# EasyEDA schematic 1-Schematic_kr04.json

## Sheets
1 Processor_Board_1: TITLE: Принципиальная схема блока процессора; REV: 1.4; Date: 2023-12-02; Sheet: 1/2; Drawn By: Romych; Company: zx-pk.ru
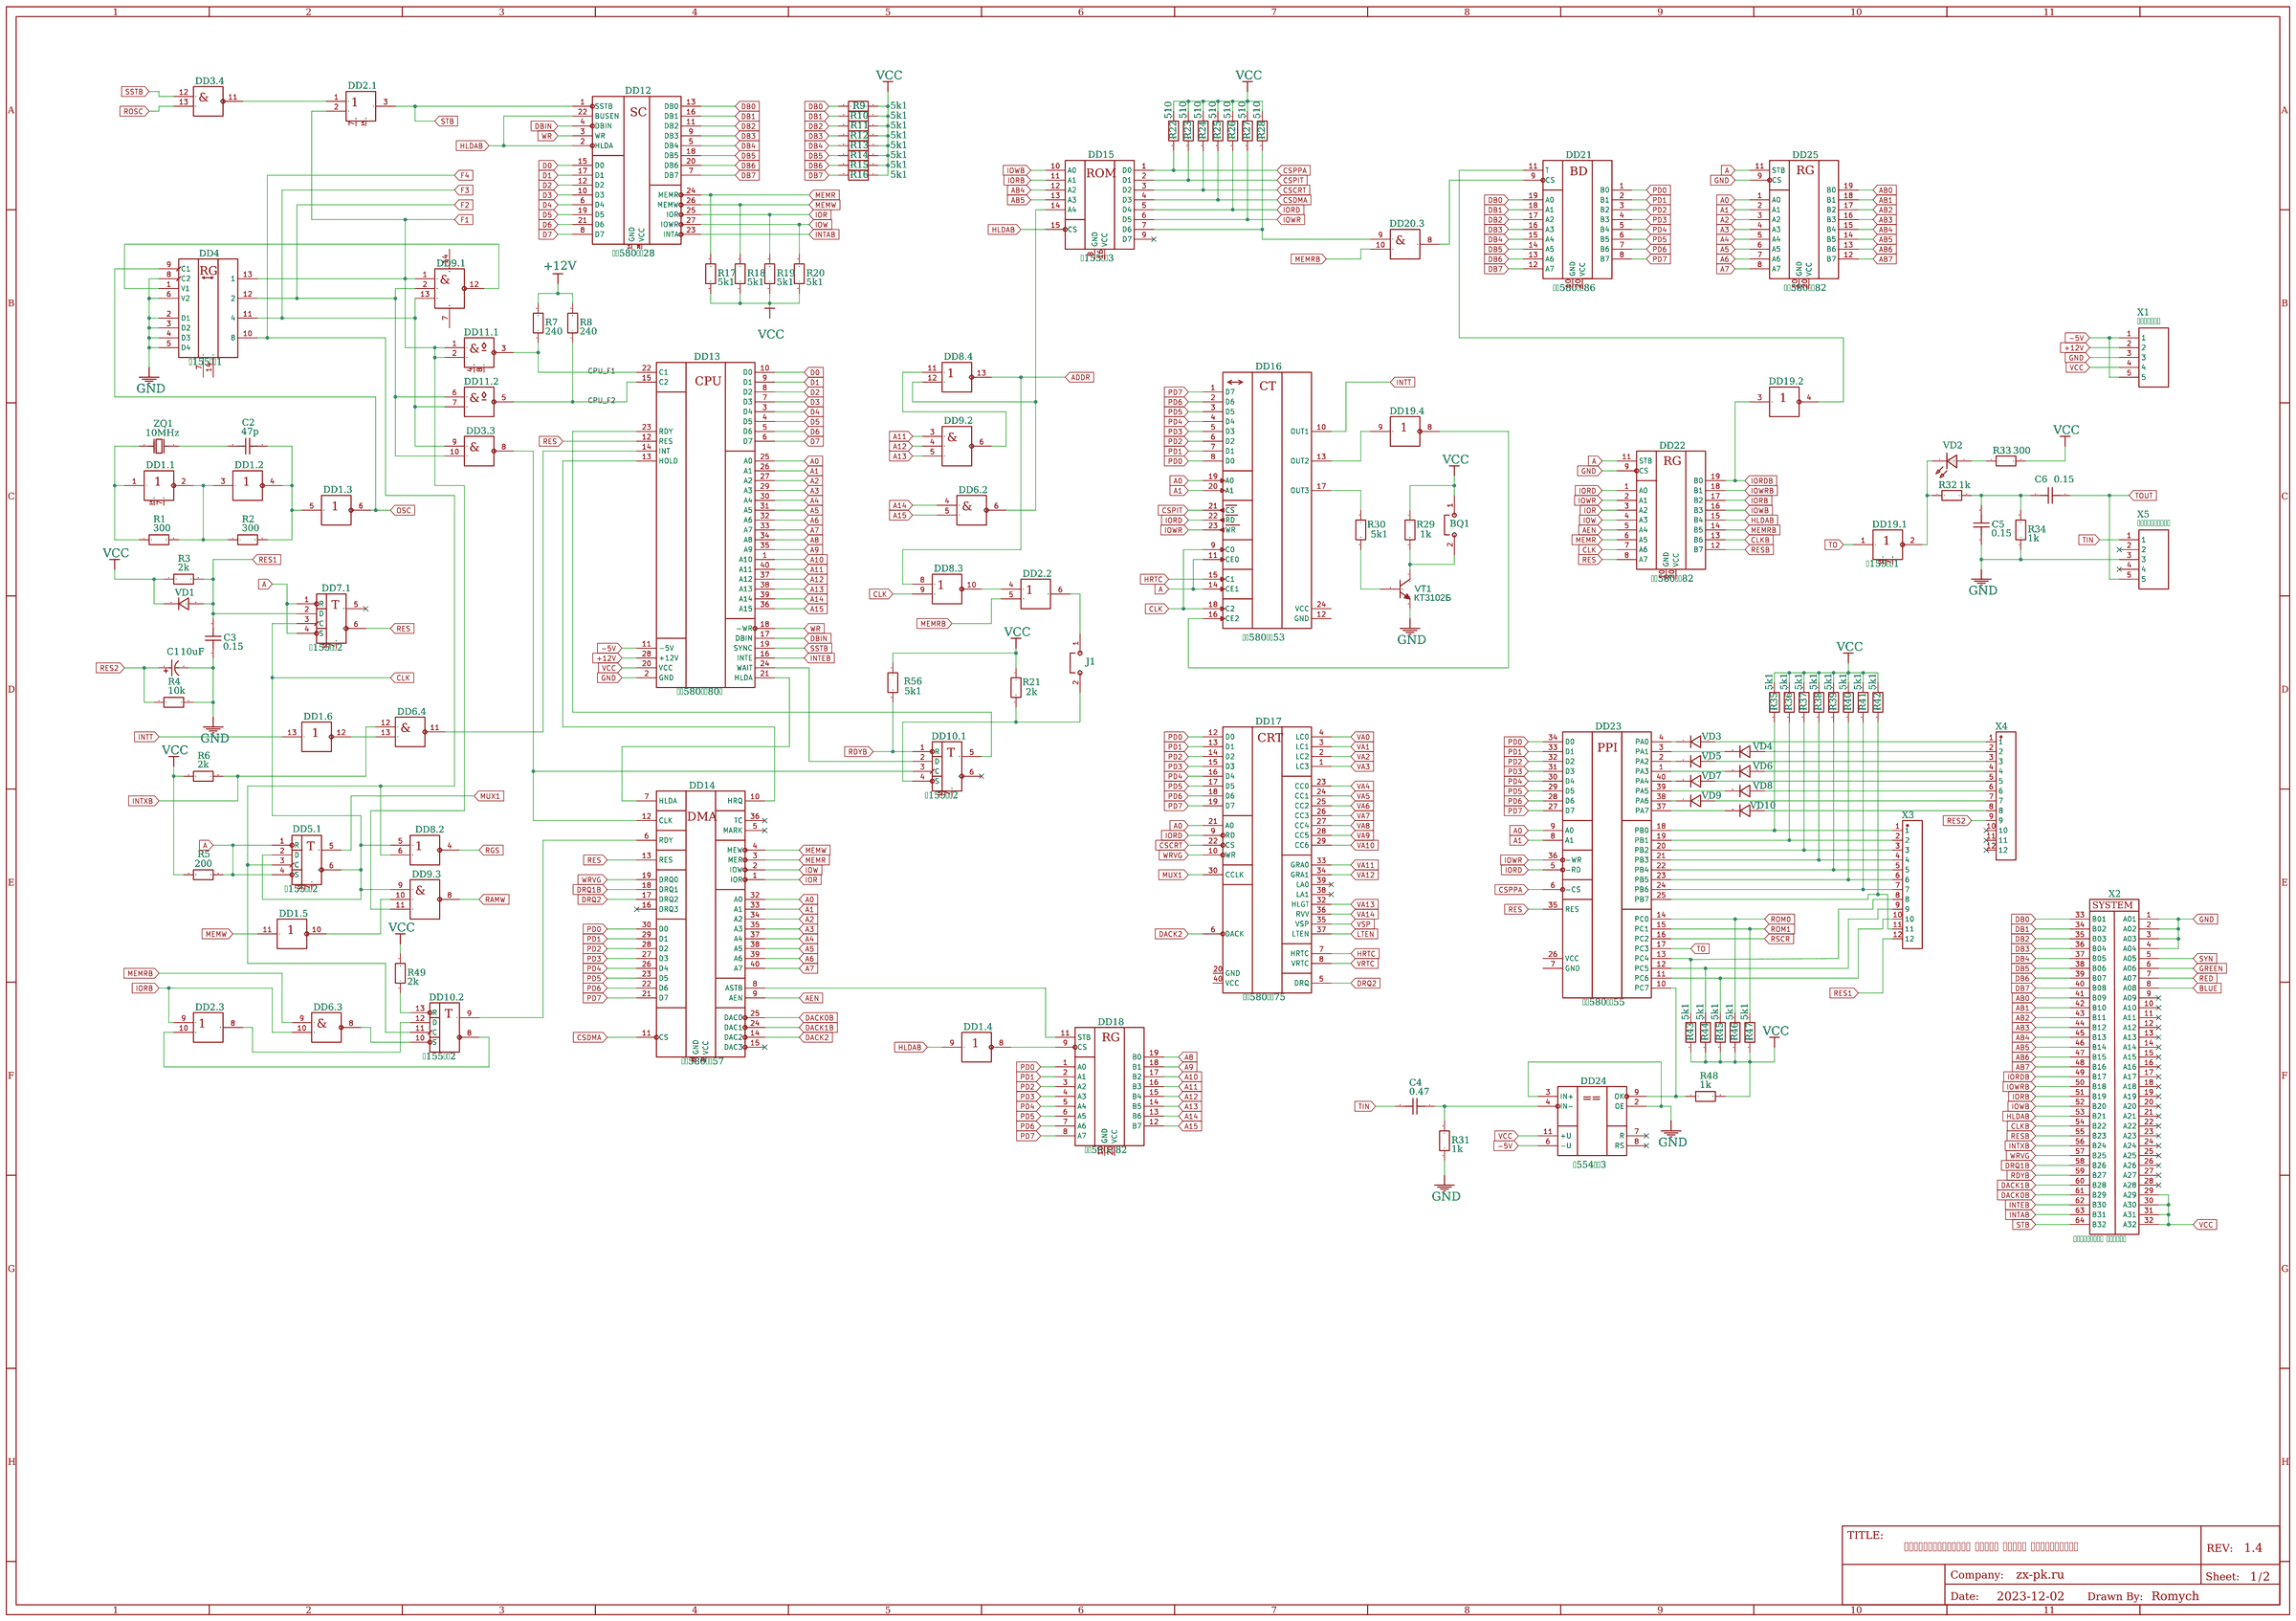
[diagram p0: Processor_Board_1]
2 Processor_Board_2: Sheet: 2/2
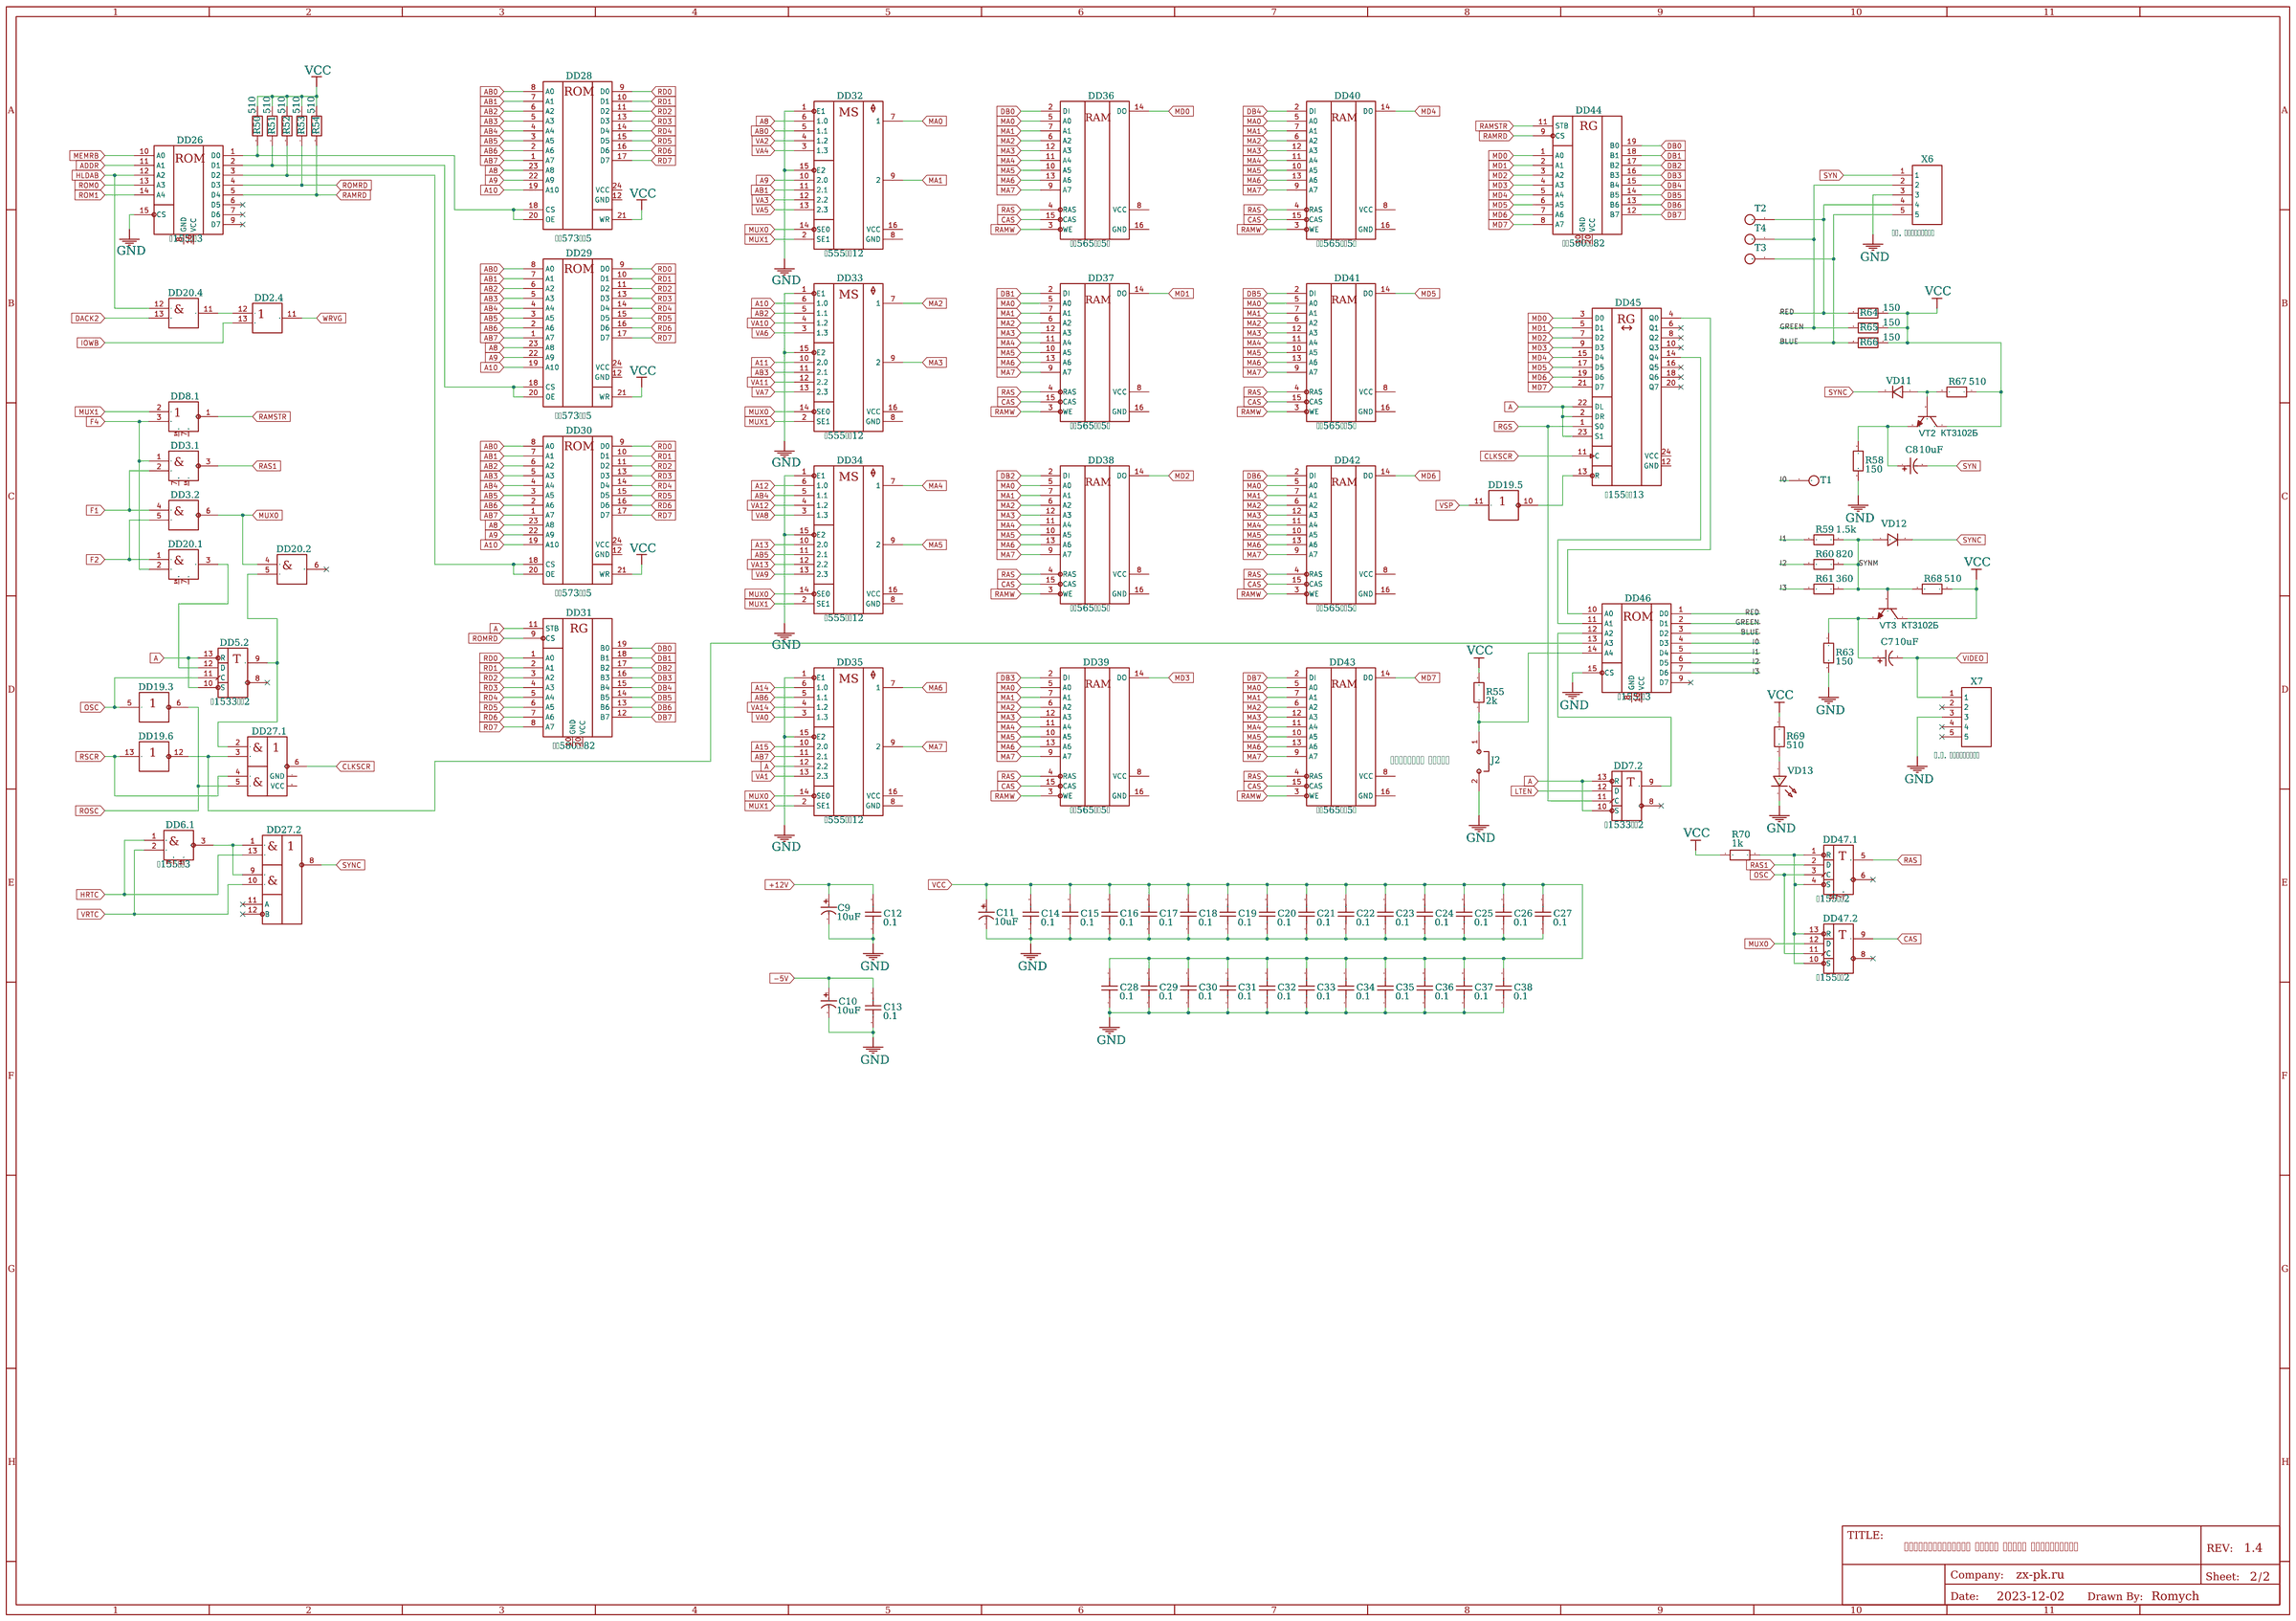
[diagram p1: Processor_Board_2]

## Parts
sheet Processor_Board_1
BQ1  Jumper-2PM  [HDR-TH_2P-P2.54-V-M]
C1  10uF  [CAP-TH_BD6.3-P2.50-D1.0-FD]
C2  47p  [CAP-TH_L7.0-W3.0-P5.00-D0.9]
C3  0.15  [CAP-TH_L5.08]
C4  0.47  [CAP-TH_L5.08]
C5  0.15  [CAP-TH_L5.08]
C6  0.15  [CAP-TH_L5.08]
DD1  К155ЛН1  [DIP-14_STD]  (sections 1,2,3,4,5,6)
DD2  К155ЛЛ1  [DIP-14_STD]  (sections 1,2,3,4)
DD4  К155ИР1  [DIP-14_STD]
DD5  К155ТМ2  [DIP-14_STD]  (sections 1,2)
DD7  К155ТМ2  [DIP-14_STD]  (sections 1,2)
DD9  К155ЛА4  [DIP-14_STD]  (sections 1,2,3)
DD10  К155ТМ2  [DIP-14_STD]  (sections 1,2)
DD11  К155ЛА18  [DIP-8_STD]  (sections 1,2)
DD12  КР580ВК28  [DIP-28_STD]
DD13  КР580ВМ80А  [DIP-40_STD]
DD14  КР580ВТ57  [DIP-40_STD]
DD15  К155РЕ3  [DIP-16_STD]
DD16  КР580ВИ53  [DIP-24_STD]
DD17  КР580ВГ75  [DIP-40_STD]
DD18  КР580ИР82  [DIP-20_STD]
DD19  К155ЛН1  [DIP-14_STD]  (sections 1,2,3,4,5,6)
DD21  КР580ВА86  [DIP-20_STD]
DD22  КР580ИР82  [DIP-20_STD]
DD23  КР580ВВ55  [DIP-40_STD]
DD24  К554СА3  [DIP-14_STD]
DD25  КР580ИР82  [DIP-20_STD]
J1  Jumper-2PM  [HDR-TH_2P-P2.54-V-M]
R1  300  [R_0.25_L13.97]
R2  300  [R_0.25_L13.97]
R3  2k  [R_0.25_L12.7]
R4  10k  [R_0.25_L12.7]
R5  200  [R_0.25_L12.7]
R6  2k  [R_0.25_L12.7]
R7  240  [R_0.5_L15.24]
R8  240  [R_0.5_L15.24]
R9  5k1  [R_0.25_L12.7]
R10  5k1  [R_0.25_L12.7]
R11  5k1  [R_0.25_L12.7]
R12  5k1  [R_0.25_L12.7]
R13  5k1  [R_0.25_L12.7]
R14  5k1  [R_0.25_L12.7]
R15  5k1  [R_0.25_L12.7]
R16  5k1  [R_0.25_L12.7]
R17  5k1  [R_0.25_L12.7]
R18  5k1  [R_0.25_L12.7]
R19  5k1  [R_0.25_L12.7]
R20  5k1  [R_0.25_L12.7]
R21  2k  [R_0.25_L12.7]
R22  510  [R_0.25_L12.7]
R23  510  [R_0.25_L12.7]
R24  510  [R_0.25_L12.7]
R25  510  [R_0.25_L12.7]
R26  510  [R_0.25_L12.7]
R27  510  [R_0.25_L12.7]
R28  510  [R_0.25_L12.7]
R29  1k  [R_0.25_L12.7]
R30  5k1  [R_0.25_L12.7]
R31  1k  [R_0.25_L12.7]
R32  1k  [R_0.25_L12.7]
R33  300  [R_0.25_L12.7]
R34  1k  [R_0.25_L12.7]
R35  5k1  [R_0.25_L12.7]
R36  5k1  [R_0.25_L12.7]
R37  5k1  [R_0.25_L12.7]
R38  5k1  [R_0.25_L12.7]
R39  5k1  [R_0.25_L12.7]
R40  5k1  [R_0.25_L12.7]
R41  5k1  [R_0.25_L12.7]
R42  5k1  [R_0.25_L12.7]
R43  5k1  [R_0.25_L12.7]
R44  5k1  [R_0.25_L12.7]
R45  5k1  [R_0.25_L12.7]
R46  5k1  [R_0.25_L12.7]
R47  5k1  [R_0.25_L12.7]
R48  1k  [R_0.25_L12.7]
R49  2k  [R_0.25_L12.7]
R56  5k1  [R_0.25_L12.7]
VD1  1N4148  [D-TH_L10.16]
VD2  ЗАПИСЬ  [LED-TH_L2.54]
VD3  1N4148  [D-TH_L10.16]
VD4  1N4148  [D-TH_L10.16]
VD5  1N4148  [D-TH_L10.16]
VD6  1N4148  [D-TH_L10.16]
VD7  1N4148  [D-TH_L10.16]
VD8  1N4148  [D-TH_L10.16]
VD9  1N4148  [D-TH_L10.16]
VD10  1N4148  [D-TH_L10.16]
VT1  КТ3102Б  [TO-92-3_L4.9-W3.7-P2.54-L]
X1  ПИТАНИЕ  [SG5-TH]
X2  СИСТЕМНЫЙ РАЗЪЕМ  [SYS_CONN_OPRO_32X2]
X3  PZ254-1-12-Z-8.5  [HDR-TH_12P-P2.54-V-M]
X4  PZ254-1-12-Z-8.5  [HDR-TH_12P-P2.54-V-M]
X5  МАГНИТОФОН  [SG5-TH]
ZQ1  10MHz  [OSC-49U-1]
sheet Processor_Board_2
C7  10uF  [CAP-TH_BD6.3-P2.50-D1.0-FD]
C8  10uF  [CAP-TH_BD6.3-P2.50-D1.0-FD]
C9  10uF  [CAP-TH_BD6.3-P2.50-D1.0-FD]
C10  10uF  [CAP-TH_BD6.3-P2.50-D1.0-FD]
C11  10uF  [CAP-TH_BD6.3-P2.50-D1.0-FD]
C12  0.1  [CAP-TH_L5.08]
C13  0.1  [CAP-TH_L5.08]
C14  0.1  [CAP-TH_L5.08]
C15  0.1  [CAP-TH_L5.08]
C16  0.1  [CAP-TH_L5.08]
C17  0.1  [CAP-TH_L5.08]
C18  0.1  [CAP-TH_L5.08]
C19  0.1  [CAP-TH_L5.08]
C20  0.1  [CAP-TH_L5.08]
C21  0.1  [CAP-TH_L5.08]
C22  0.1  [CAP-TH_L5.08]
C23  0.1  [CAP-TH_L5.08]
C24  0.1  [CAP-TH_L5.08]
C25  0.1  [CAP-TH_L5.08]
C26  0.1  [CAP-TH_L5.08]
C27  0.1  [CAP-TH_L5.08]
C28  0.1  [CAP-TH_L5.08]
C29  0.1  [CAP-TH_L5.08]
C30  0.1  [CAP-TH_L5.08]
C31  0.1  [CAP-TH_L5.08]
C32  0.1  [CAP-TH_L5.08]
C33  0.1  [CAP-TH_L5.08]
C34  0.1  [CAP-TH_L5.08]
C35  0.1  [CAP-TH_L5.08]
C36  0.1  [CAP-TH_L5.08]
C37  0.1  [CAP-TH_L5.08]
C38  0.1  [CAP-TH_L5.08]
DD3  К155ЛА3  [DIP-14_STD]  (sections 1,2,3,4)
DD6  К155ЛА3  [DIP-14_STD]  (sections 1,2,3,4)
DD8  К155ЛЕ1  [DIP-14_STD]  (sections 1,2,3,4)
DD20  К155ЛИ1  [DIP-14_STD]  (sections 1,2,3,4)
DD26  К155РЕ3  [DIP-16_STD]
DD27  К155ЛР1  [DIP-14_STD]  (sections 1,2)
DD28  КР573РФ5  [DIP-24_STD]
DD29  КР573РФ5  [DIP-24_STD]
DD30  КР573РФ5  [DIP-24_STD]
DD31  КР580ИР82  [DIP-20_STD]
DD32  К555КП12  [DIP-16_STD]
DD33  К555КП12  [DIP-16_STD]
DD34  К555КП12  [DIP-16_STD]
DD35  К555КП12  [DIP-16_STD]
DD36  КР565РУ5Г  [DIP-16_STD]
DD37  КР565РУ5Г  [DIP-16_STD]
DD38  КР565РУ5Г  [DIP-16_STD]
DD39  КР565РУ5Г  [DIP-16_STD]
DD40  КР565РУ5Г  [DIP-16_STD]
DD41  КР565РУ5Г  [DIP-16_STD]
DD42  КР565РУ5Г  [DIP-16_STD]
DD43  КР565РУ5Г  [DIP-16_STD]
DD44  КР580ИР82  [DIP-20_STD]
DD45  К155ИР13  [DIP-24_STD]
DD46  К155РЕ3  [DIP-16_STD]
DD47  К155ТМ2  [DIP-14_STD]  (sections 1,2)
J2  Jumper-2PM  [HDR-TH_2P-P2.54-V-M]
R50  510  [R_0.25_L12.7]
R51  510  [R_0.25_L12.7]
R52  510  [R_0.25_L12.7]
R53  510  [R_0.25_L12.7]
R54  510  [R_0.25_L12.7]
R55  2k  [R_0.25_L12.7]
R58  150  [R_0.25_L12.7]
R59  1.5k  [R_0.25_L12.7]
R60  820  [R_0.25_L12.7]
R61  360  [R_0.25_L12.7]
R63  150  [R_0.25_L12.7]
R64  150  [R_0.25_L12.7]
R65  150  [R_0.25_L12.7]
R66  150  [R_0.25_L12.7]
R67  510  [R_0.25_L12.7]
R68  510  [R_0.25_L12.7]
R69  510  [R_0.25_L12.7]
R70  1k  [R_0.25_L12.7]
T1  I  [TH-TEST-1]
T2  R  [TH-TEST-1]
T3  B  [TH-TEST-1]
T4  G  [TH-TEST-1]
VD11  1N4148  [D-TH_L10.16]
VD12  1N4148  [D-TH_L10.16]
VD13  ПИТАНИЕ  [LED-TH_L2.54]
VT2  КТ3102Б  [TO-92-3_L4.9-W3.7-P2.54-L]
VT3  КТ3102Б  [TO-92-3_L4.9-W3.7-P2.54-L]
X6  ЦВ. ТЕЛЕВИЗОР  [SG5-TH]
X7  Ч.Б. ТЕЛЕВИЗОР  [SG5-TH]

## Library data of the parts
BQ1 J1 J2 = Jumper-2PM: Contributor: Roman Boykov
C1 C7-C11 = ECLJ0612220M101P00: Supplier: LCSC; Supplier Part: C156809; Manufacturer: Guangdong TOPAZ Elec Tech; Contributor: LCSC
C2-C6 C12-C38 = CK45-R3AD152K-VRY: Supplier: LCSC; Supplier Part: C340608; Manufacturer: TDK; Contributor: LCSC
DD1 DD19 = К1533ЛН1: Supplier: chipdip; Contributor: Roman Boykov; subpart_no: 7
DD2 = К1533ЛЛ1: Supplier: chipdip; Contributor: Roman Boykov; subpart_no: 1
DD4 = К155ИР1: Supplier: chipdip; Contributor: romychs_4693
DD5 DD7 DD10 DD47 = К1533ТМ2: Supplier: chipdip; Contributor: romychs_4693; subpart_no: 3
DD9 = К1533ЛА4: Supplier: chipdip; Contributor: Roman Boykov; subpart_no: 2
DD11 = К1533ЛА18: Supplier: chipdip; Contributor: Roman Boykov; subpart_no: 1
DD12 = КР580ВК28: Contributor: romychs_4693
DD13 = КР580ВМ80А: Contributor: romychs_4693
DD14 = КР580ВТ57: Contributor: romychs_4693
DD15 DD26 DD46 = К155РЕ3: Contributor: romychs_4693
DD16 = КР580ВИ53: Supplier: chip-dip; Contributor: romychs_4693
DD17 = КР580ВГ75: Contributor: Roman Boykov
DD18 DD22 DD25 DD31 DD44 = КР580ИР82: Contributor: Roman Boykov
DD21 = КР580ВА86: Contributor: Roman Boykov
DD23 = КР580ВВ55: Supplier: chipdip; Contributor: romychs_4693
DD24 = К554СА3: Contributor: romychs_4693
R1-R56 R58-R61 R63-R70 = R_0603_EU: Contributor: LCEDA_Lib
VD1 VD3-VD12 = 1N4148: Contributor: EasyEDA
VD2 VD13 = LED-0603_R: Manufacturer: EVERLIGHT(台湾亿光); Manufacturer Part: 19-217/R6C-AL1M2VY/3T; Supplier Part: C72044; Supplier: LCSC; Contributor: LCEDA_01
VT1-VT3 = BC547BTF: Supplier: LCSC; Supplier Part: C900798; Manufacturer: ON(安森美); Contributor: LCSC
X1 X5-X7 = СГ5: Contributor: Roman Boykov
X2 = SysConnOPro-32x2: Supplier: chipdip; Contributor: Roman Boykov
X3 X4 = PZ254-1-12-Z-8.5: Supplier: LCSC; Supplier Part: C2894935; Manufacturer: HCTL(华灿天禄); Contributor: LCSC
ZQ1 = X49UD12MSD2SC: Supplier: LCSC; Manufacturer: YXC; Supplier Part: C2188
DD3 DD6 = К1533ЛА3: Supplier: chipdip; Contributor: Roman Boykov; subpart_no: 1
DD8 = К1533ЛЕ1: Supplier: chipdip; Contributor: Roman Boykov; subpart_no: 1
DD20 = К1533ЛИ1: Supplier: chipdip; Contributor: Roman Boykov; subpart_no: 1
DD27 = К155ЛР1: Contributor: romychs_4693; subpart_no: 1
DD28-DD30 = КР573РФ5: Contributor: Roman Boykov
DD32-DD35 = К1533КП12: Supplier: chipdip; Contributor: romychs_4693
DD36-DD43 = КР565РУ5Г: Supplier: chipdip; Contributor: romychs_4693
DD45 = К155ИР13: Contributor: romychs_4693
T1-T4 = TH-TEST-1: Contributor: romychs_4693

## Nets
+12V: C9.1 C12.2 DD13.28(+12V) R7.2 R8.2 X1.2
-5V: C10.1 C13.2 DD13.11(-5V) DD24.6(-U) X1.1 X1.5
GND: C1.2 C3.1 C5.1 C9.2 C10.2 C11.2 C12.1 C13.1 C14.1 C15.1 C16.1 C17.1 C18.1 C19.1 C20.1 C21.1 C22.1 C23.1 C24.1 C25.1 C26.1 C27.1 C28.1 C29.1 C30.1 C31.1 C32.1 C33.1 C34.1 C35.1 C36.1 C37.1 C38.1 DD4.2(D1) DD4.3(D2) DD4.4(D3) DD4.5(D4) DD4.6(V2) DD4.8(C2) DD13.2(GND) DD22.9(CS) DD24.2(OE) DD24.3(IN+) DD25.9(CS) DD26.15(CS) DD32.1(E1) DD32.15(E2) DD33.1(E1) DD33.15(E2) DD34.1(E1) DD34.15(E2) DD35.1(E1) DD35.15(E2) DD46.15(CS) J2.2 R4.2 R31.1 R34.1 R58.2 R63.2 VD13.2 VT1.3(E) X1.3 X2.1(A01) X2.2(A02) X2.3(A03) X2.4(A04) X5.3 X6.3 X7.3
VCC: BQ1.1 C11.1 C14.2 C15.2 C16.2 C17.2 C18.2 C19.2 C20.2 C21.2 C22.2 C23.2 C24.2 C25.2 C26.2 C27.2 C28.2 C29.2 C30.2 C31.2 C32.2 C33.2 C34.2 C35.2 C36.2 C37.2 C38.2 DD13.20(VCC) DD24.11(+U) DD28.21(WR) DD29.21(WR) DD30.21(WR) R3.1 R5.1 R6.1 R9.1 R10.1 R11.1 R12.1 R13.1 R14.1 R15.1 R16.1 R17.1 R18.1 R19.1 R20.1 R21.1 R22.1 R23.1 R24.1 R25.1 R26.1 R27.1 R28.1 R29.1 R33.2 R35.1 R36.1 R37.1 R38.1 R39.1 R40.1 R41.1 R42.1 R43.2 R44.2 R45.2 R46.2 R47.2 R48.2 R49.2 R50.1 R51.1 R52.1 R53.1 R54.1 R55.2 R56.1 R64.1 R65.1 R66.1 R67.1 R68.1 R69.1 R70.1 VD1.2(K) VT2.1(C) VT3.1(C) X1.4 X2.29(A29) X2.30(A30) X2.31(A31) X2.32(A32)
A: DD5.1(R) DD5.4(S) DD5.10(S) DD5.13(R) DD7.1(R) DD7.4(S) DD7.10(S) DD7.13(R) DD16.11(CE0) DD16.14(CE1) DD22.11(STB) DD25.11(STB) DD31.11(STB) DD35.12(2.2) DD45.2(DR) DD45.22(DL) DD45.23(S1) R5.2
A0: DD13.25(A0) DD14.32(A0) DD16.19(A0) DD17.21(A0) DD23.9(A0) DD25.1(A0)
A1: DD13.26(A1) DD14.33(A1) DD16.20(A1) DD23.8(A1) DD25.2(A1)
A2: DD13.27(A2) DD14.34(A2) DD25.3(A2)
A3: DD13.29(A3) DD14.35(A3) DD25.4(A3)
A4: DD13.30(A4) DD14.37(A4) DD25.5(A4)
A5: DD13.31(A5) DD14.38(A5) DD25.6(A5)
A6: DD13.32(A6) DD14.39(A6) DD25.7(A6)
A7: DD13.33(A7) DD14.40(A7) DD25.8(A7)
A8: DD13.34(A8) DD18.19(B0) DD28.23(A8) DD29.23(A8) DD30.23(A8) DD32.6(1.0)
A9: DD13.35(A9) DD18.18(B1) DD28.22(A9) DD29.22(A9) DD30.22(A9) DD32.10(2.0)
A10: DD13.1(A10) DD18.17(B2) DD28.19(A10) DD29.19(A10) DD30.19(A10) DD33.6(1.0)
A11: DD9.3(I1) DD13.40(A11) DD18.16(B3) DD33.10(2.0)
A12: DD9.4(I2) DD13.37(A12) DD18.15(B4) DD34.6(1.0)
A13: DD9.5(I3) DD13.38(A13) DD18.14(B5) DD34.10(2.0)
A14: DD6.4(1) DD13.39(A14) DD18.13(B6) DD35.6(1.0)
A15: DD6.5(2) DD13.36(A15) DD18.12(B7) DD35.10(2.0)
AB0: DD25.19(B0) DD28.8(A0) DD29.8(A0) DD30.8(A0) DD32.5(1.1) X2.41(B09)
AB1: DD25.18(B1) DD28.7(A1) DD29.7(A1) DD30.7(A1) DD32.11(2.1) X2.42(B10)
AB2: DD25.17(B2) DD28.6(A2) DD29.6(A2) DD30.6(A2) DD33.5(1.1) X2.43(B11)
AB3: DD25.16(B3) DD28.5(A3) DD29.5(A3) DD30.5(A3) DD33.11(2.1) X2.44(B12)
AB4: DD15.12(A2) DD25.15(B4) DD28.4(A4) DD29.4(A4) DD30.4(A4) DD34.5(1.1) X2.45(B13)
AB5: DD15.13(A3) DD25.14(B5) DD28.3(A5) DD29.3(A5) DD30.3(A5) DD34.11(2.1) X2.46(B14)
AB6: DD25.13(B6) DD28.2(A6) DD29.2(A6) DD30.2(A6) DD35.5(1.1) X2.47(B15)
AB7: DD25.12(B7) DD28.1(A7) DD29.1(A7) DD30.1(A7) DD35.11(2.1) X2.48(B16)
ADDR: DD8.8(1) DD8.13(3) DD26.11(A1)
AEN: DD14.9(AEN) DD22.5(A4)
BLUE: DD46.3(D2) R66.2 T3.1(TP1) X2.8(A08) X6.5
CAS: DD36.15(CAS) DD37.15(CAS) DD38.15(CAS) DD39.15(CAS) DD40.15(CAS) DD41.15(CAS) DD42.15(CAS) DD43.15(CAS) DD47.9(Q)
CLK: DD5.2(D) DD5.6(&#126;Q) DD7.3(С) DD8.5(1) DD8.9(2) DD9.9(I1) DD16.9(C0) DD16.18(C2) DD22.7(A6)
CLKB: DD22.13(B6) X2.54(B22)
CLKSCR: DD27.6(O) DD45.11(C)
CPU_F1: DD11.3 DD13.22(С1) R7.1
CPU_F2: DD11.5(3) DD13.15(С2) R8.1
CSCRT: DD15.3(D2) DD17.22(CS) R24.2
CSDMA: DD14.11(CS) DD15.4(D3) R25.2
CSPIT: DD15.2(D1) DD16.21(CS) R23.2
CSPPA: DD15.1(D0) DD23.6(-CS) R22.2
D0: DD12.15(D0) DD13.10(D0)
D1: DD12.17(D1) DD13.9(D1)
D2: DD12.12(D2) DD13.8(D2)
D3: DD12.10(D3) DD13.7(D3)
D4: DD12.6(D4) DD13.3(D4)
D5: DD12.19(D5) DD13.4(D5)
D6: DD12.21(D6) DD13.5(D6)
D7: DD12.8(D7) DD13.6(D7)
DACK0B: DD14.25(DAC0) X2.61(B29)
DACK1B: DD14.24(DAC1) X2.60(B28)
DACK2: DD14.14(DAC2) DD17.6(DACK) DD20.13(2)
DB0: DD12.13(DB0) DD21.19(A0) DD31.19(B0) DD36.2(DI) DD44.19(B0) R9.2 X2.33(B01)
DB1: DD12.16(DB1) DD21.18(A1) DD31.18(B1) DD37.2(DI) DD44.18(B1) R10.2 X2.34(B02)
DB2: DD12.11(DB2) DD21.17(A2) DD31.17(B2) DD38.2(DI) DD44.17(B2) R11.2 X2.35(B03)
DB3: DD12.9(DB3) DD21.16(A3) DD31.16(B3) DD39.2(DI) DD44.16(B3) R12.2 X2.36(B04)
DB4: DD12.5(DB4) DD21.15(A4) DD31.15(B4) DD40.2(DI) DD44.15(B4) R13.2 X2.37(B05)
DB5: DD12.18(DB5) DD21.14(A5) DD31.14(B5) DD41.2(DI) DD44.14(B5) R14.2 X2.38(B06)
DB6: DD12.20(DB6) DD21.13(A6) DD31.13(B6) DD42.2(DI) DD44.13(B6) R15.2 X2.39(B07)
DB7: DD12.7(DB7) DD21.12(A7) DD31.12(B7) DD43.2(DI) DD44.12(B7) R16.2 X2.40(B08)
DBIN: DD12.4(DBIN) DD13.17(DBIN)
DRQ1B: DD14.18(DRQ1) X2.58(B26)
DRQ2: DD14.17(DRQ2) DD17.5(DRQ)
F1: DD2.2 DD3.2 DD3.4(1) DD4.13(1) DD9.1(I1) DD9.11(I3) DD11.1 DD11.2
F2: DD3.5(2) DD3.10(2) DD4.12(2) DD9.2(I2) DD11.6(1) DD20.1
F3: DD3.9(1) DD4.11(4) DD9.13(I3) DD11.7(2)
F4: DD3.1 DD4.10(8) DD5.3(С) DD8.3(2) DD8.6(2) DD10.11(C) DD20.2
GREEN: DD46.2(D1) R65.2 T4.1(TP1) X2.6(A06) X6.2
HLDAB: DD1.9(1) DD12.2(HLDA) DD12.22(BUSEN) DD15.15(CS) DD20.12(1) DD22.15(B4) DD26.12(A2) X2.53(B21)
HRTC: DD6.1 DD16.15(C1) DD17.7(HRTC) DD27.13(I2)
I0: DD46.4(D3) T1.1(TP1)
I1: DD46.5(D4) R59.2
I2: DD46.6(D5) R60.2
I3: DD46.7(D6) R61.2
INTAB: DD12.23(INTA) X2.63(B31)
INTEB: DD13.16(INTE) X2.62(B30)
INTT: DD1.13(1) DD16.10(OUT1)
INTXB: DD6.12(1) R6.2 X2.56(B24)
IOR: DD12.25(IOR) DD14.1(IOR) DD22.3(A2) R19.2
IORB: DD2.9(1) DD6.10(2) DD15.11(A1) DD22.17(B2) X2.51(B19)
IORD: DD15.5(D4) DD16.22(RD) DD17.9(RD) DD22.1(A0) DD23.5(-RD) R26.2
IORDB: DD19.3(1) DD22.19(B0) X2.49(B17)
IOW: DD12.27(IOWR) DD14.2(IOW) DD22.4(A3) R20.2
IOWB: DD2.13(2) DD15.10(A0) DD22.16(B3) X2.52(B20)
IOWR: DD15.6(D5) DD16.23(WR) DD22.2(A1) DD23.36(-WR) R27.2
IOWRB: DD22.18(B1) X2.50(B18)
LTEN: DD7.12(D) DD17.37(LTEN)
MA0: DD32.7(1) DD36.5(A0) DD37.5(A0) DD38.5(A0) DD39.5(A0) DD40.5(A0) DD41.5(A0) DD42.5(A0) DD43.5(A0)
MA1: DD32.9(2) DD36.7(A1) DD37.7(A1) DD38.7(A1) DD39.7(A1) DD40.7(A1) DD41.7(A1) DD42.7(A1) DD43.7(A1)
MA2: DD33.7(1) DD36.6(A2) DD37.6(A2) DD38.6(A2) DD39.6(A2) DD40.6(A2) DD41.6(A2) DD42.6(A2) DD43.6(A2)
MA3: DD33.9(2) DD36.12(A3) DD37.12(A3) DD38.12(A3) DD39.12(A3) DD40.12(A3) DD41.12(A3) DD42.12(A3) DD43.12(A3)
MA4: DD34.7(1) DD36.11(A4) DD37.11(A4) DD38.11(A4) DD39.11(A4) DD40.11(A4) DD41.11(A4) DD42.11(A4) DD43.11(A4)
MA5: DD34.9(2) DD36.10(A5) DD37.10(A5) DD38.10(A5) DD39.10(A5) DD40.10(A5) DD41.10(A5) DD42.10(A5) DD43.10(A5)
MA6: DD35.7(1) DD36.13(A6) DD37.13(A6) DD38.13(A6) DD39.13(A6) DD40.13(A6) DD41.13(A6) DD42.13(A6) DD43.13(A6)
MA7: DD35.9(2) DD36.9(A7) DD37.9(A7) DD38.9(A7) DD39.9(A7) DD40.9(A7) DD41.9(A7) DD42.9(A7) DD43.9(A7)
MD0: DD36.14(DO) DD44.1(A0) DD45.3(D0)
MD1: DD37.14(DO) DD44.2(A1) DD45.5(D1)
MD2: DD38.14(DO) DD44.3(A2) DD45.7(D2)
MD3: DD39.14(DO) DD44.4(A3) DD45.9(D3)
MD4: DD40.14(DO) DD44.5(A4) DD45.15(D4)
MD5: DD41.14(DO) DD44.6(A5) DD45.17(D5)
MD6: DD42.14(DO) DD44.7(A6) DD45.19(D6)
MD7: DD43.14(DO) DD44.8(A7) DD45.21(D7)
MEMR: DD12.24(MEMR) DD14.3(MER) DD22.6(A5) R17.2
MEMRB: DD2.5(2) DD6.9(1) DD20.10(2) DD22.14(B5) DD26.10(A0)
MEMW: DD1.11(1) DD12.26(MEMW) DD14.4(MEW) R18.2
MUX0: DD3.6(3) DD20.4(1) DD32.14(SE0) DD33.14(SE0) DD34.14(SE0) DD35.14(SE0) DD47.12(D)
MUX1: DD5.5(Q) DD8.2(1) DD17.30(CCLK) DD32.2(SE1) DD33.2(SE1) DD34.2(SE1) DD35.2(SE1)
OSC: DD1.6(2) DD4.9(C1) DD5.11(C) DD19.5(1) DD47.3(С) DD47.11(C)
PD0: DD14.30(D0) DD16.8(D0) DD17.12(D0) DD18.1(A0) DD21.1(B0) DD23.34(D0)
PD1: DD14.29(D1) DD16.7(D1) DD17.13(D1) DD18.2(A1) DD21.2(B1) DD23.33(D1)
PD2: DD14.28(D2) DD16.6(D2) DD17.14(D2) DD18.3(A2) DD21.3(B2) DD23.32(D2)
PD3: DD14.27(D3) DD16.5(D3) DD17.15(D3) DD18.4(A3) DD21.4(B3) DD23.31(D3)
PD4: DD14.26(D4) DD16.4(D4) DD17.16(D4) DD18.5(A4) DD21.5(B4) DD23.30(D4)
PD5: DD14.23(D5) DD16.3(D5) DD17.17(D5) DD18.6(A5) DD21.6(B5) DD23.29(D5)
PD6: DD14.22(D6) DD16.2(D6) DD17.18(D6) DD18.7(A6) DD21.7(B6) DD23.28(D6)
PD7: DD14.21(D7) DD16.1(D7) DD17.19(D7) DD18.8(A7) DD21.8(B7) DD23.27(D7)
RAMRD: DD26.5(D4) DD44.9(CS) R54.2
RAMSTR: DD8.1(3) DD44.11(STB)
RAMW: DD9.8(O) DD36.3(WE) DD37.3(WE) DD38.3(WE) DD39.3(WE) DD40.3(WE) DD41.3(WE) DD42.3(WE) DD43.3(WE)
RAS: DD36.4(RAS) DD37.4(RAS) DD38.4(RAS) DD39.4(RAS) DD40.4(RAS) DD41.4(RAS) DD42.4(RAS) DD43.4(RAS) DD47.5(Q)
RAS1: DD3.3 DD47.2(D)
RD0: DD28.9(D0) DD29.9(D0) DD30.9(D0) DD31.1(A0)
RD1: DD28.10(D1) DD29.10(D1) DD30.10(D1) DD31.2(A1)
RD2: DD28.11(D2) DD29.11(D2) DD30.11(D2) DD31.3(A2)
RD3: DD28.13(D3) DD29.13(D3) DD30.13(D3) DD31.4(A3)
RD4: DD28.14(D4) DD29.14(D4) DD30.14(D4) DD31.5(A4)
RD5: DD28.15(D5) DD29.15(D5) DD30.15(D5) DD31.6(A5)
RD6: DD28.16(D6) DD29.16(D6) DD30.16(D6) DD31.7(A6)
RD7: DD28.17(D7) DD29.17(D7) DD30.17(D7) DD31.8(A7)
RDYB: DD10.1(R) R56.2 X2.59(B27)
RED: DD46.1(D0) R64.2 T2.1(TP1) X2.7(A07) X6.4
RES: DD7.6(&#126;Q) DD13.12(RES) DD14.13(RES) DD22.8(A7) DD23.35(RES)
RES1: C3.2 DD7.2(D) R3.2 VD1.1(A) X3.12
RES2: C1.1 R4.1 X4.9
RESB: DD22.12(B7) X2.55(B23)
RGS: DD7.11(C) DD8.4(3) DD45.1(S0)
ROM0: DD23.14(PC0) DD26.13(A3) R46.1
ROM1: DD23.15(PC1) DD26.14(A4) R47.1
ROMRD: DD26.4(D3) DD31.9(CS) R53.2
ROSC: DD3.13(2) DD19.6(2) DD27.5(I4)
RSCR: DD19.13(1) DD23.16(PC2) DD27.4(I3)
SSTB: DD3.12(1) DD13.19(SYNC)
STB: DD2.3 DD12.1(SSTB) X2.64(B32)
SYN: C8.2 X2.5(A05) X6.1
SYNC: DD27.8(O) VD11.2(K) VD12.2(K)
SYNM: R59.1 R60.1 R61.1 R68.2 VD12.1(A) VT3.2(B)
TIN: C4.2 X5.1
TO: DD19.1 DD23.17(PC3)
TOUT: C6.1 X5.5
VA0: DD17.4(LC0) DD35.3(1.3)
VA1: DD17.3(LC1) DD35.13(2.3)
VA2: DD17.2(LC2) DD32.4(1.2)
VA3: DD17.1(LC3) DD32.12(2.2)
VA4: DD17.23(CC0) DD32.3(1.3)
VA5: DD17.24(CC1) DD32.13(2.3)
VA6: DD17.25(CC2) DD33.3(1.3)
VA7: DD17.26(CC3) DD33.13(2.3)
VA8: DD17.27(CC4) DD34.3(1.3)
VA9: DD17.28(CC5) DD34.13(2.3)
VA10: DD17.29(CC6) DD33.4(1.2)
VA11: DD17.33(GRA0) DD33.12(2.2)
VA12: DD17.34(GRA1) DD34.4(1.2)
VA13: DD17.32(HLGT) DD34.12(2.2)
VA14: DD17.36(RVV) DD35.4(1.2)
VIDEO: C7.2 X7.1
VRTC: DD6.2 DD17.8(VRTC) DD27.10(I4)
VSP: DD17.35(VSP) DD19.11(1)
WR: DD12.3(WR) DD13.18(-WR)
WRVG: DD2.11(3) DD14.19(DRQ0) DD17.10(WR) X2.57(B25)
Net-(BQ1-2): BQ1.2 R29.2 VT1.1(C)
Net-(C2-1): C2.1 DD1.4(2) DD1.5(1) R2.2
Net-(C2-2): C2.2 ZQ1.1(OSC1)
Net-(C4-1): C4.1 DD24.4(IN-) R31.2
Net-(C5-2): C5.2 C6.2 R32.2 R34.2
Net-(C7-1): C7.1 R63.1 VT3.3(E)
Net-(C8-1): C8.1 R58.1 VT2.3(E)
Net-(DD1.1-1): DD1.1 R1.1 ZQ1.2(OSC2)
Net-(DD1.1-2): DD1.2 DD1.3(1) R1.2 R2.1
Net-(DD1.4-8): DD1.8(2) DD18.9(CS)
Net-(DD1.5-10): DD1.10(2) DD9.10(I2)
Net-(DD1.6-12): DD1.12(2) DD6.13(2)
Net-(DD2.1-1): DD2.1 DD3.11(3)
Net-(DD2.2-4): DD2.4(1) DD8.10(3)
Net-(DD2.2-6): DD2.6(3) J1.1
Net-(DD2.3-8): DD2.8(3) DD10.12(D)
Net-(DD2.3-10): DD2.10(2) DD10.8(-Q)
Net-(DD2.4-12): DD2.12(1) DD20.11(3)
Net-(DD3.3-8): DD3.8(3) DD10.3(С) DD14.12(CLK)
Net-(DD4-1): DD4.1(V1) DD9.12(O)
Net-(DD5.2-9): DD5.9(Q) DD20.5(2) DD27.2(I1)
Net-(DD5.2-12): DD5.12(D) DD20.3
Net-(DD6.1-3): DD6.3 DD27.1(I1) DD27.9(I3)
Net-(DD6.2-6): DD6.6(3) DD8.12(2) DD15.14(A4)
Net-(DD6.3-8): DD6.8(3) DD10.10(S)
Net-(DD6.4-11): DD6.11(3) DD13.14(INT)
Net-(DD7.2-9): DD7.9(Q) DD46.12(A2)
Net-(DD8.4-11): DD8.11(1) DD9.6(O)
Net-(DD10.1-2): DD10.2(D) DD13.24(WAIT)
Net-(DD10.1-4): DD10.4(S) J1.2 R21.2
Net-(DD10.1-5): DD10.5(Q) DD13.23(RDY)
Net-(DD10.2-9): DD10.9(Q) DD14.6(RDY)
Net-(DD10.2-13): DD10.13(R) R49.1
Net-(DD13-13): DD13.13(HOLD) DD14.10(HRQ)
Net-(DD13-21): DD13.21(HLDA) DD14.7(HLDA)
Net-(DD14-8): DD14.8(ASTB) DD18.11(STB)
Net-(DD15-7): DD15.7(D6) DD20.9(1) R28.2
Net-(DD16-13): DD16.13(OUT2) DD19.9(1)
Net-(DD16-16): DD16.16(CE2) DD19.8(2)
Net-(DD16-17): DD16.17(OUT3) R30.1
Net-(DD19.1-2): DD19.2 R32.1 VD2.2
Net-(DD19.2-4): DD19.4(2) DD21.11(T)
Net-(DD19.5-10): DD19.10(2) DD45.13(R)
Net-(DD19.6-12): DD19.12(2) DD27.3(I2) DD46.13(A3)
Net-(DD20.3-8): DD20.8(3) DD21.9(CS)
Net-(DD23-1): DD23.1(PA3) VD6.2(K)
Net-(DD23-2): DD23.2(PA2) VD5.2(K)
Net-(DD23-3): DD23.3(PA1) VD4.2(K)
Net-(DD23-4): DD23.4(PA0) VD3.2(K)
Net-(DD23-10): DD23.10(PC7) DD24.9(OK) R48.1
Net-(DD23-11): DD23.11(PC6) R45.1 X3.10
Net-(DD23-12): DD23.12(PC5) R44.1 X3.9
Net-(DD23-13): DD23.13(PC4) R43.1 X3.8
Net-(DD23-18): DD23.18(PB0) R35.2 X3.1
Net-(DD23-19): DD23.19(PB1) R36.2 X3.2
Net-(DD23-20): DD23.20(PB2) R37.2 X3.3
Net-(DD23-21): DD23.21(PB3) R38.2 X3.4
Net-(DD23-22): DD23.22(PB4) R39.2 X3.5
Net-(DD23-23): DD23.23(PB5) R40.2 X3.6
Net-(DD23-24): DD23.24(PB6) R41.2 X3.7
Net-(DD23-25): DD23.25(PB7) R42.2 X3.11
Net-(DD23-37): DD23.37(PA7) VD10.2(K)
Net-(DD23-38): DD23.38(PA6) VD9.2(K)
Net-(DD23-39): DD23.39(PA5) VD8.2(K)
Net-(DD23-40): DD23.40(PA4) VD7.2(K)
Net-(DD26-1): DD26.1(D0) DD28.18(CS) DD28.20(OE) R50.2
Net-(DD26-2): DD26.2(D1) DD29.18(CS) DD29.20(OE) R51.2
Net-(DD26-3): DD26.3(D2) DD30.18(CS) DD30.20(OE) R52.2
Net-(DD45-4): DD45.4(Q0) DD46.10(A0)
Net-(DD45-14): DD45.14(Q4) DD46.11(A1)
Net-(DD46-14): DD46.14(A4) J2.1 R55.1
Net-(DD47.1-1): DD47.1(R) DD47.4(S) DD47.10(S) DD47.13(R) R70.2
Net-(R30-2): R30.2 VT1.2(B)
Net-(R33-1): R33.1 VD2.1
Net-(R67-2): R67.2 VD11.1(A) VT2.2(B)
Net-(R69-2): R69.2 VD13.1
Net-(VD3-1): VD3.1(A) X4.1
Net-(VD4-1): VD4.1(A) X4.2
Net-(VD5-1): VD5.1(A) X4.3
Net-(VD6-1): VD6.1(A) X4.4
Net-(VD7-1): VD7.1(A) X4.5
Net-(VD8-1): VD8.1(A) X4.6
Net-(VD9-1): VD9.1(A) X4.7
Net-(VD10-1): VD10.1(A) X4.8

Not connected (* = marked no-connect by the designer): DD1 7(GND) 14(VCC); DD2 7(GND) 14(VCC); DD3 7(GND) 14(VCC); DD4 7(GND) 14(VCC); DD5 7(GND) 8(-Q)* 14(VCC); DD6 7(GND) 14(VCC); DD7 5(Q)* 7(GND) 8(-Q)* 14(VCC); DD8 7(GND) 14(VCC); DD9 7(GND) 14(VCC); DD10 6(&#126;Q)* 7(GND) 14(VCC); DD11 4(GND) 8(VCC); DD12 14(GND) 28(VCC); DD14 5(MARK)* 15(DAC3)* 16(DRQ3)* 20(GND) 31(VCC) 36(TC)*; DD15 8(GND) 9(D7)* 16(VCC); DD16 12(GND) 24(VCC); DD17 20(GND) 38(LA1)* 39(LA0)* 40(VCC); DD18 10(GND) 20(VCC); DD19 7(GND) 14(VCC); DD20 6(3)* 7(GND) 14(VCC); DD21 10(GND) 20(VCC); DD22 10(GND) 20(VCC); DD23 7(GND) 26(VCC); DD24 7(R)* 8(RS)*; DD25 10(GND) 20(VCC); DD26 6(D5)* 7(D6)* 8(GND) 9(D7)* 16(VCC); DD27 7(GND) 11(A)* 12(B)* 14(VCC); DD28 12(GND) 24(VCC); DD29 12(GND) 24(VCC); DD30 12(GND) 24(VCC); DD31 10(GND) 20(VCC); DD32 8(GND) 16(VCC); DD33 8(GND) 16(VCC); DD34 8(GND) 16(VCC); DD35 8(GND) 16(VCC); DD36 8(VCC) 16(GND); DD37 8(VCC) 16(GND); DD38 8(VCC) 16(GND); DD39 8(VCC) 16(GND); DD40 8(VCC) 16(GND); DD41 8(VCC) 16(GND); DD42 8(VCC) 16(GND); DD43 8(VCC) 16(GND); DD44 10(GND) 20(VCC); DD45 6(Q1)* 8(Q2)* 10(Q3)* 12(GND) 16(Q5)* 18(Q6)* 20(Q7)* 24(VCC); DD46 8(GND) 9(D7)* 16(VCC); DD47 6(&#126;Q)* 7(GND) 8(-Q)* 14(VCC); X2 9(A09)* 10(A10)* 11(A11)* 12(A12)* 13(A13)* 14(A14)* 15(A15)* 16(A16)* 17(A17)* 18(A18)* 19(A19)* 20(A20)* 21(A21)* 22(A22)* 23(A23)* 24(A24)* 25(A25)* 26(A26)* 27(A27)* 28(A28)*; X4 10* 11* 12*; X5 2* 4*; X7 2* 4* 5*

## Notes on the sheets
sheet 2
- Инверсия цвета
